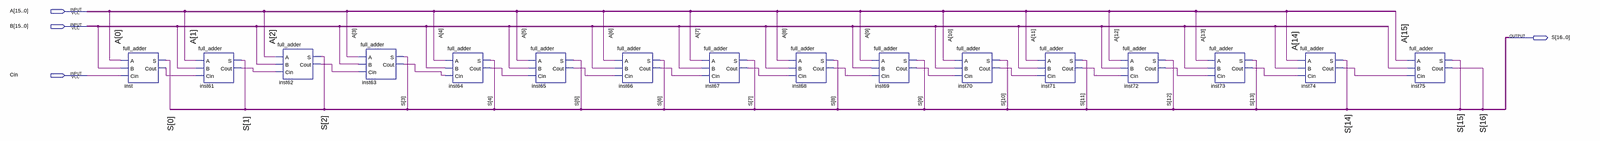
[diagram p0: schematic sheet, whole]
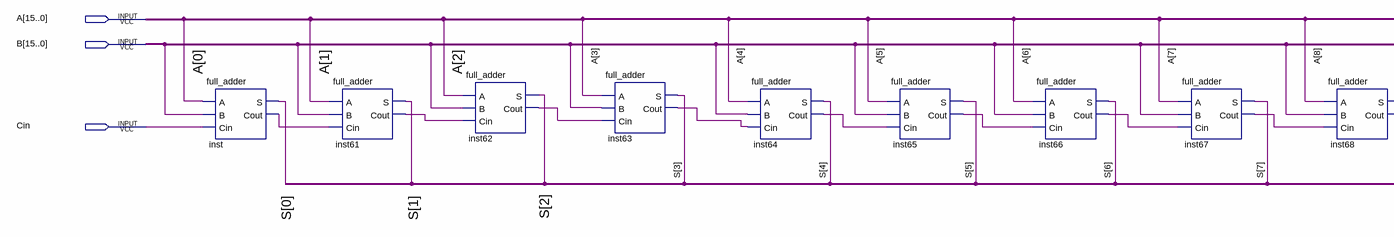
[diagram p1: schematic sheet, left part]
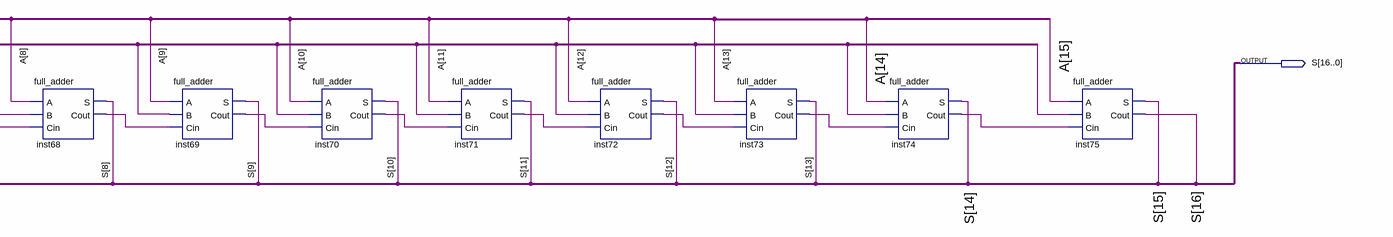
[diagram p2: schematic sheet, right part]
// Quartus schematic behavioural_logic.bdf as structural Verilog: 16 symbols, 4 pins
module behavioural_logic (
  input  [15:0] A,
  input  [15:0] B,
  input  Cin,
  output [16:0] S
);

  wire inst61_cout, inst62_cout, inst63_cout, inst64_cout, inst65_cout, inst66_cout, inst67_cout,
       inst68_cout, inst69_cout, inst70_cout, inst71_cout, inst72_cout, inst73_cout, inst74_cout, inst_cout;

  full_adder inst (.A(A[0]), .B(B[0]), .Cin(Cin), .S(S[0]), .Cout(inst_cout));
  full_adder inst61 (.A(A[1]), .B(B[1]), .Cin(inst_cout), .S(S[1]), .Cout(inst61_cout));
  full_adder inst62 (.A(A[2]), .B(B[2]), .Cin(inst61_cout), .S(S[2]), .Cout(inst62_cout));
  full_adder inst63 (.A(A[3]), .B(B[3]), .Cin(inst62_cout), .S(S[3]), .Cout(inst63_cout));
  full_adder inst64 (.A(A[4]), .B(B[4]), .Cin(inst63_cout), .S(S[4]), .Cout(inst64_cout));
  full_adder inst65 (.A(A[5]), .B(B[5]), .Cin(inst64_cout), .S(S[5]), .Cout(inst65_cout));
  full_adder inst66 (.A(A[6]), .B(B[6]), .Cin(inst65_cout), .S(S[6]), .Cout(inst66_cout));
  full_adder inst67 (.A(A[7]), .B(B[7]), .Cin(inst66_cout), .S(S[7]), .Cout(inst67_cout));
  full_adder inst68 (.A(A[8]), .B(B[8]), .Cin(inst67_cout), .S(S[8]), .Cout(inst68_cout));
  full_adder inst69 (.A(A[9]), .B(B[9]), .Cin(inst68_cout), .S(S[9]), .Cout(inst69_cout));
  full_adder inst70 (.A(A[10]), .B(B[10]), .Cin(inst69_cout), .S(S[10]), .Cout(inst70_cout));
  full_adder inst71 (.A(A[11]), .B(B[11]), .Cin(inst70_cout), .S(S[11]), .Cout(inst71_cout));
  full_adder inst72 (.A(A[12]), .B(B[12]), .Cin(inst71_cout), .S(S[12]), .Cout(inst72_cout));
  full_adder inst73 (.A(A[13]), .B(B[13]), .Cin(inst72_cout), .S(S[13]), .Cout(inst73_cout));
  full_adder inst74 (.A(A[14]), .B(B[14]), .Cin(inst73_cout), .S(S[14]), .Cout(inst74_cout));
  full_adder inst75 (.A(A[15]), .B(B[15]), .Cin(inst74_cout), .S(S[15]), .Cout(S[16]));
endmodule
